# EAGLE design PDM_no_main_relay (EAGLE 7.7.0)
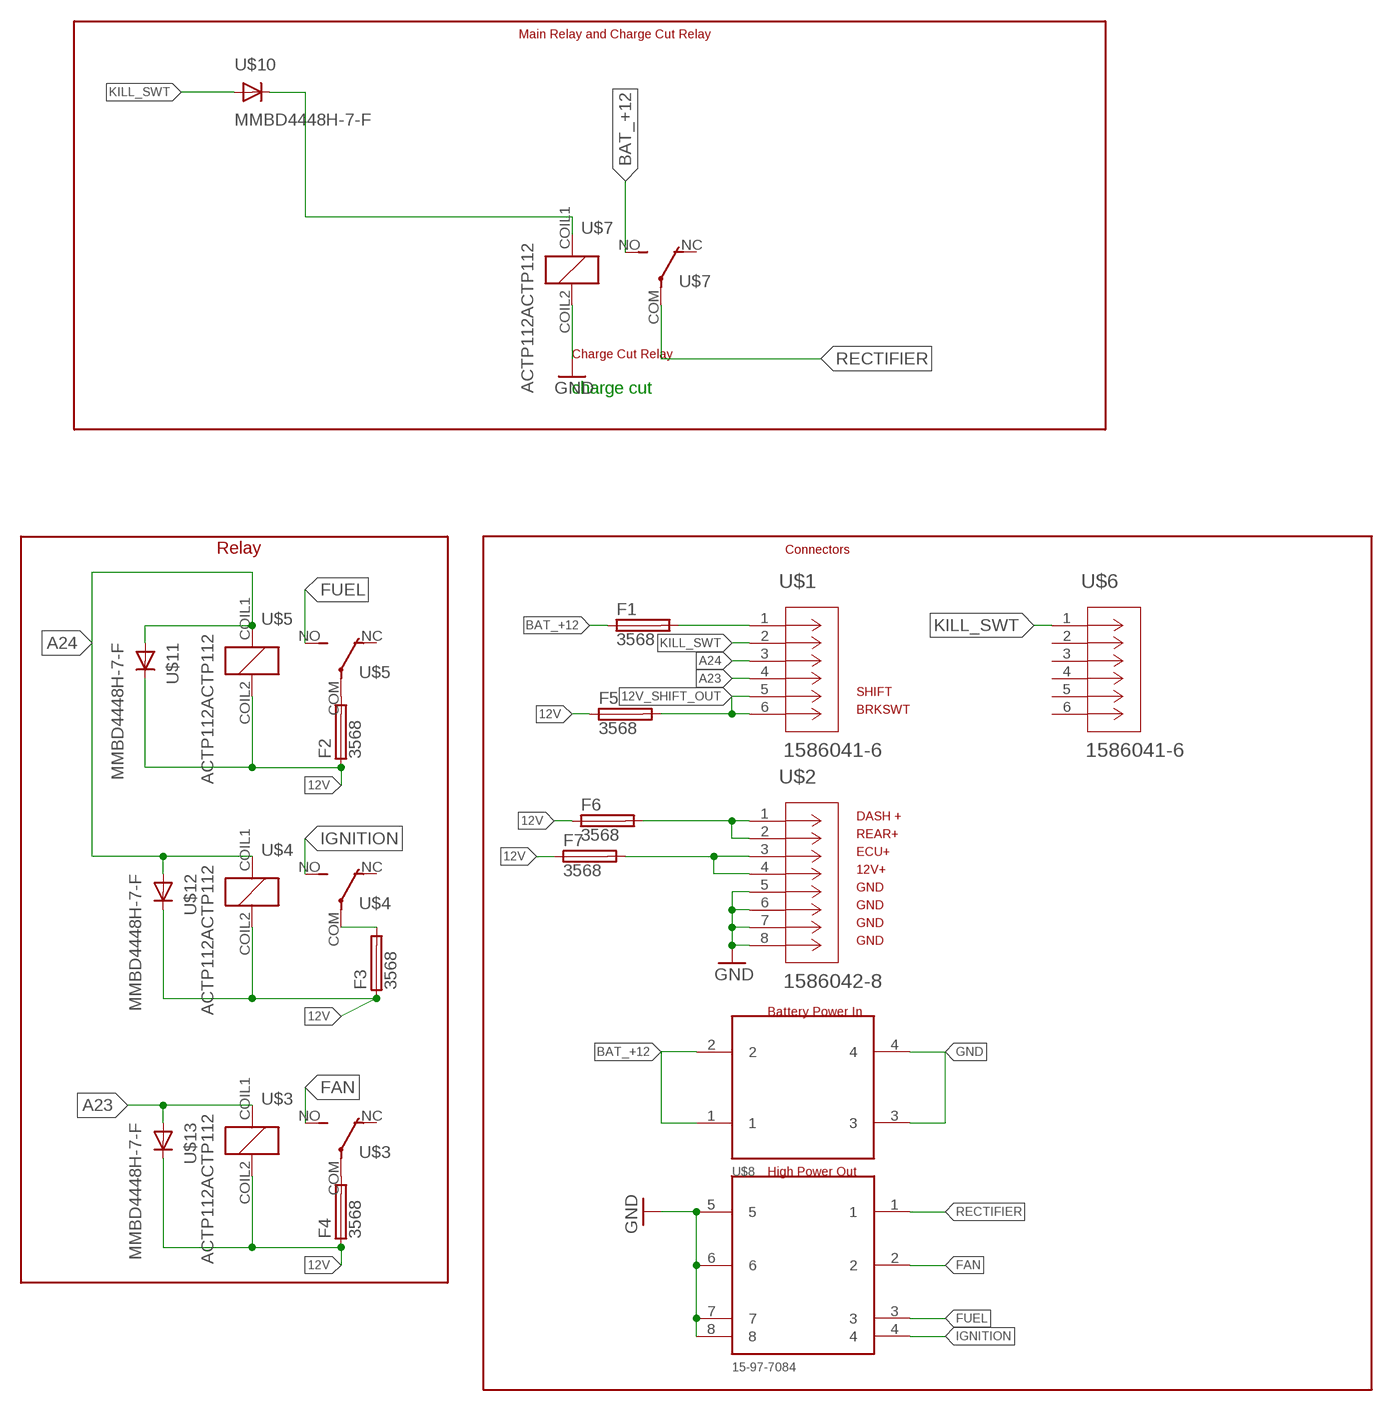
[diagram p0: schematic, sheet 1]

## Parts
F1  3568  [3568]
F2  3568  [3568]
F3  3568  [3568]
F4  3568  [3568]
F5  3568  [3568]
F6  3568  [3568]
F7  3568  [3568]
U$1  1586041-6  [1586041-6]
U$2  1586042-8  [1586042-8]
U$3  ACTP112ACTP112  [ACTP112]
U$4  ACTP112ACTP112  [ACTP112]
U$5  ACTP112ACTP112  [ACTP112]
U$6  1586041-6  [1586041-6]
U$7  ACTP112ACTP112  [ACTP112]
U$8  15-97-7084  [15-97-7084]
U$9  15-97-8043  [15-97-8043]
U$10  MMBD4448H-7-F  [SOT23-3]
U$11  MMBD4448H-7-F  [SOT23-3]
U$12  MMBD4448H-7-F  [SOT23-3]
U$13  MMBD4448H-7-F  [SOT23-3]

## Nets
12V: F2.1 F2.2 F3.1 F3.2 F4.1 F4.2 F5.1 F5.2 F6.1 F6.2 F7.1 F7.2 U$3.COIL2 U$4.COIL2 U$5.COIL2 U$11.3(C) U$12.3(C) U$13.3(C)
12V_DAQ_OUT: F6.3 F6.4 U$2.1 U$2.2
12V_FUSED_ECU: F7.3 F7.4 U$2.3 U$2.4
12V_SHIFT_OUT: F5.3 F5.4 U$1.5 U$1.6
A23: U$1.4 U$3.COIL1 U$13.1(A)
A24: U$1.3 U$4.COIL1 U$5.COIL1 U$11.1(A) U$12.1(A)
BAT_+12: F1.1 F1.2 U$7.NO U$9.1 U$9.2
BAT_+12_FUSED: F1.3 F1.4 U$1.1
CHARGE_CUT_IN: U$7.COIL1 U$10.3(C)
FAN: U$3.NO U$8.2
FAN_12V: F4.3 F4.4 U$3.COM
FUEL: U$5.NO U$8.3
FUEL_12V: F2.3 F2.4 U$5.COM
GND: U$2.5 U$2.6 U$2.7 U$2.8 U$7.COIL2 U$8.5 U$8.6 U$8.7 U$8.8 U$9.3 U$9.4
IGN_12V: F3.3 F3.4 U$4.COM
IGNITION: U$4.NO U$8.4
KILL_SWT: U$1.2 U$6.1 U$10.1(A)
RECTIFIER: U$7.COM U$8.1
Unconnected: U$3.NC U$4.NC U$5.NC U$6.2 U$6.3 U$6.4 U$6.5 U$6.6 U$7.NC

## Notes on the sheet
- Main Relay and Charge Cut Relay
- Charge Cut Relay
- charge cut
- Relay | Connectors
- SHIFT
- BRKSWT
- DASH +
- REAR+
- ECU+
- 12V+
- GND
- GND
- GND
- GND
- Battery Power In
- High Power Out

## Library data of the parts
F1-F7 = Keystone:3568: Mini ATC Fuse Holder 20A 500V 1 Circuit Blade PCB
U$1 U$6 = BMS Lbr:1586041-6: TE VAL-U-LOK TPA 6 Pin Header
U$2 = BMS Lbr:1586042-8: 1586042-8 8 pin Val-U-Lock TPA
U$3-U$5 U$7 = panasonic:ACTP112: ACTP112 Through-Hole Micro Relay
U$8 = molex:15-97-7084
U$9 = molex:15-97-8043
U$10-U$13 = diodes-inc:MMBD4448H-7-F

## Board
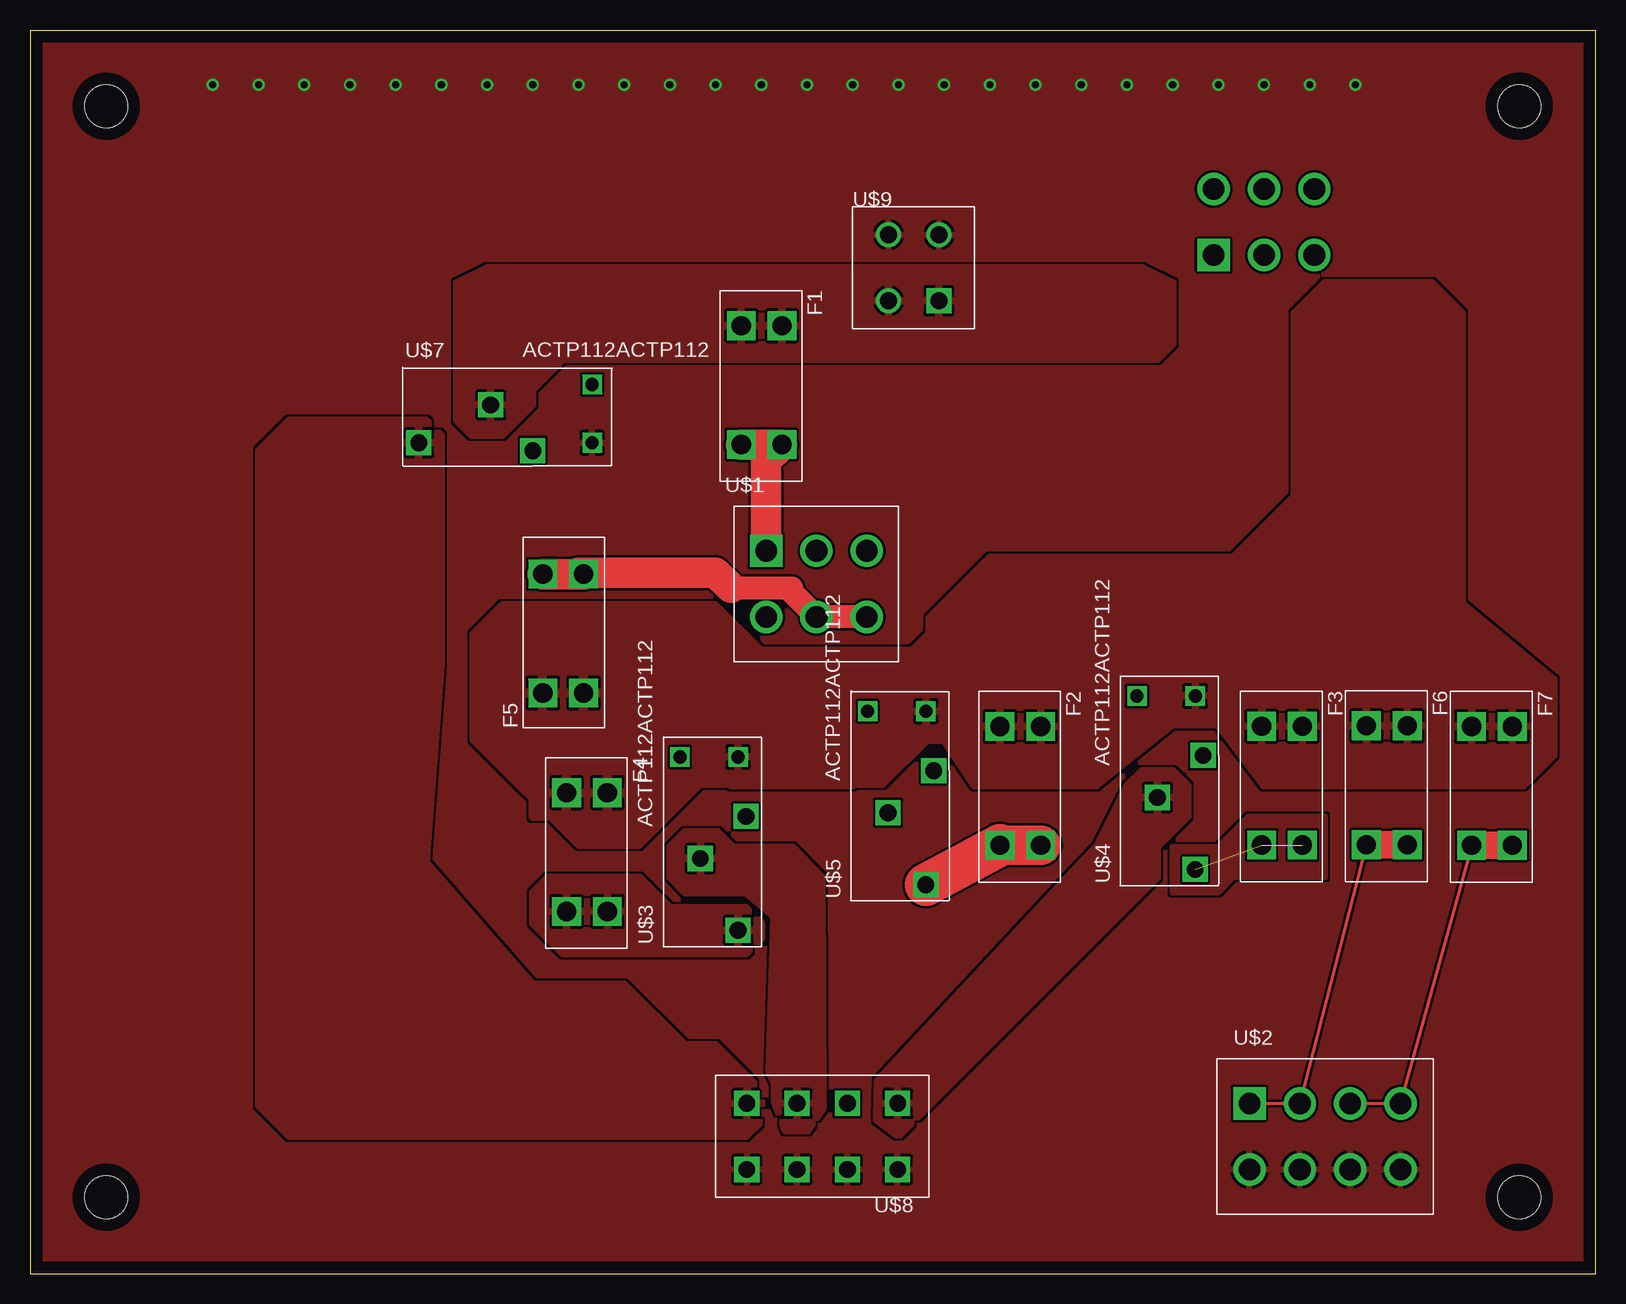
[diagram p1: board, top side]
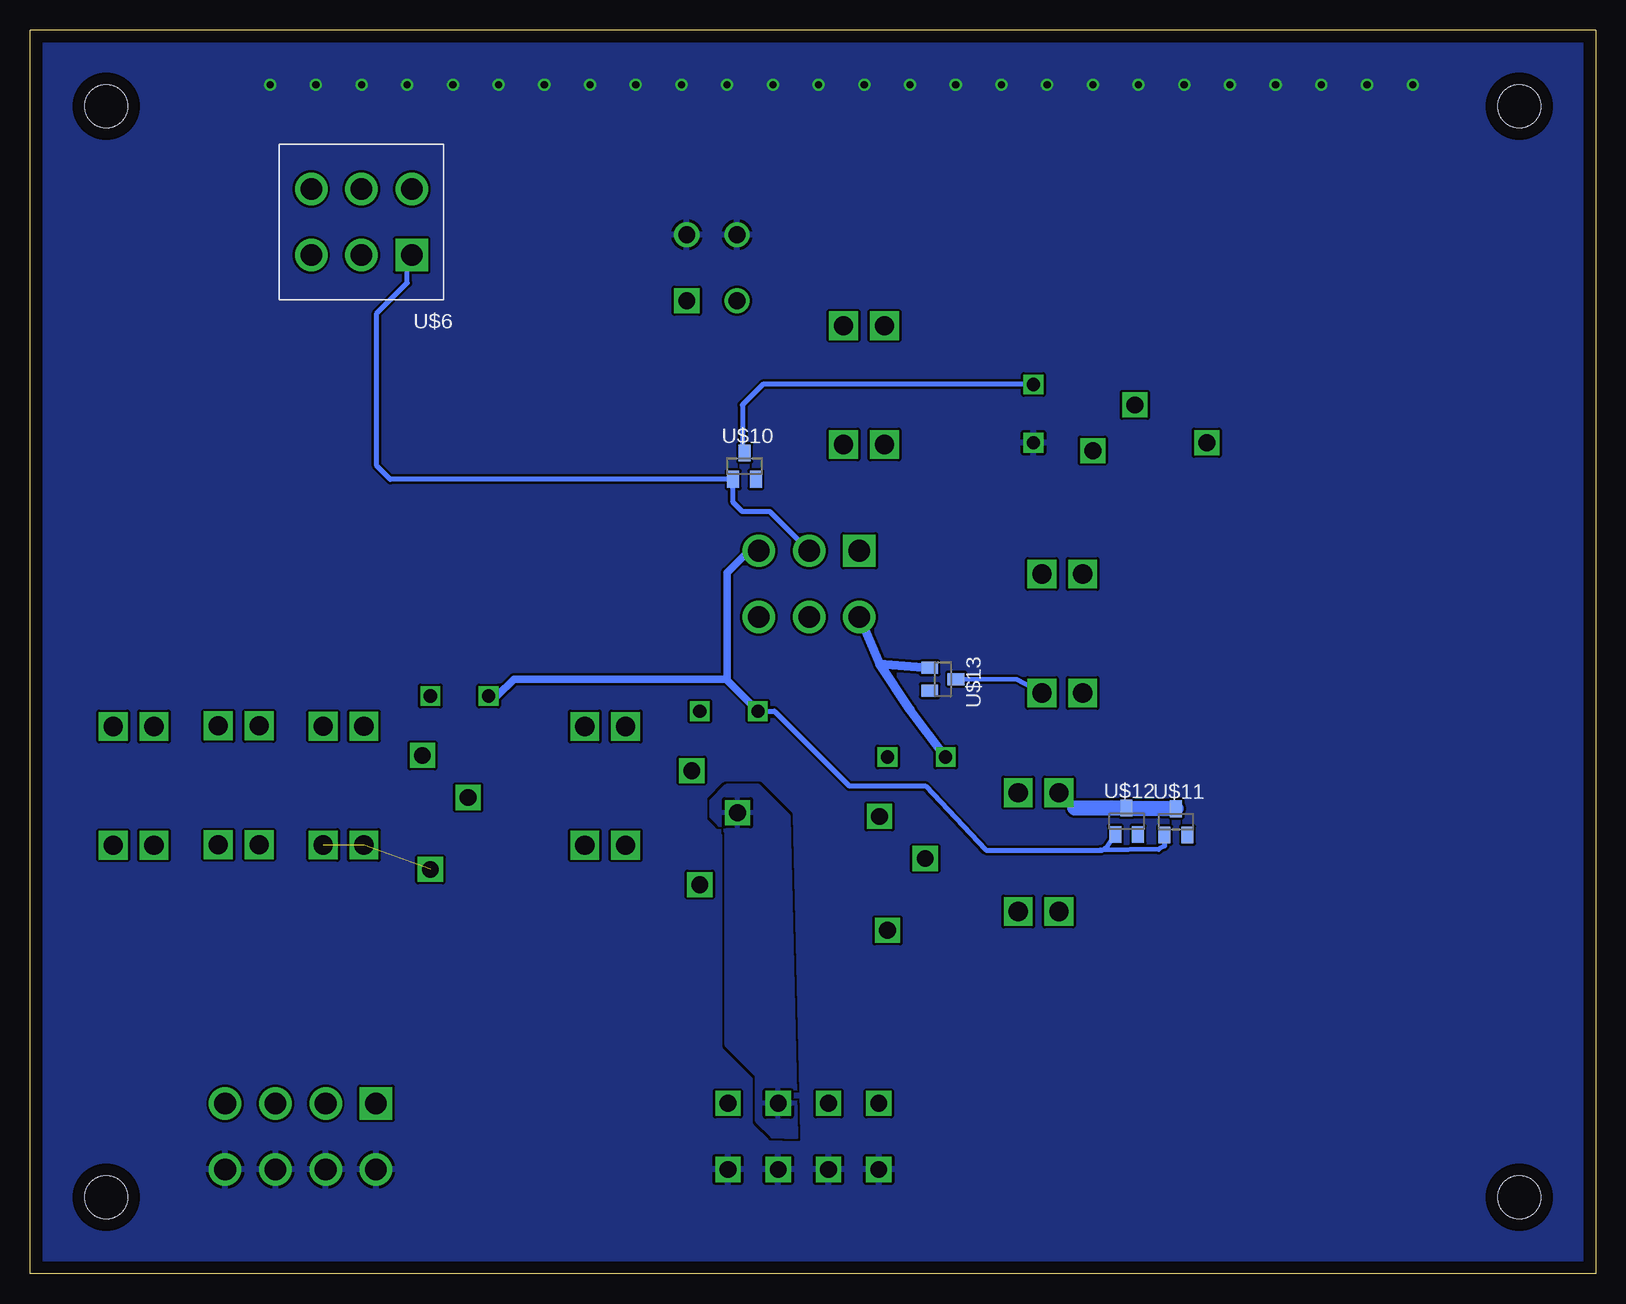
[diagram p2: board, bottom side, seen from below]

Size 130.51 x 103.63 mm. Coordinates in mm from the lower left corner, seen from the top.
Outline: 0,0 130.5,0 130.5,103.63 0,103.63 0,0
Copper layers (1*16): Top 0.035mm / dielectric 1.5mm / Bottom 0.035mm
Design rules "default": minimum track width 10mil, minimum drill 24mil, track to track 8mil, track to pad 8mil, pad to pad 8mil, via to via 8mil, smd to smd 8mil, copper to edge 40mil, drill to drill 8mil, minimum pad ring 10mil, minimum via ring 8mil, stop-mask expansion 4mil, vias tented up to drill 0mil, thermal gap 10mil
Holes 3.56 mm at 6.35,6.35 124.16,6.35 124.16,97.28 6.35,97.28

### Footprints (pad centres in the part's own frame; a part is rotated, then mirrored left to right if it is on the bottom)
3568 = drill 1.6 square: 1 -4.953,1.702; 2 -4.953,-1.702; 3 4.953,1.702; 4 4.953,-1.702
1586041-6 = drill 1.803 square: 1 -4.191,2.756 | drill 1.803: 2 0,2.756; 3 4.191,2.756; 4 -4.191,-2.756; 5 0,-2.756; 6 4.191,-2.756
1586042-8 = drill 1.803 square: 1 -6.287,2.756 | drill 1.803: 2 -2.095,2.756; 3 2.095,2.756; 4 6.287,2.756; 5 -6.287,-2.756; 6 -2.095,-2.756; 7 2.095,-2.756; 8 6.287,-2.756
ACTP112 = drill 1.092 square: COIL1 4.953,5.512; COIL2 4.953,0.66 | drill 1.397 square: COM -9.5,0.66; NC 0,0; NO -3.505,3.81
15-97-7084 = drill 1.397 square: 1 6.287,-2.756; 2 2.095,-2.756; 3 -2.095,-2.756; 4 -6.287,-2.756; 5 6.287,2.756; 6 2.095,2.756; 7 -2.095,2.756; 8 -6.287,2.756
15-97-8043 = drill 1.397 pad 1.803 square: 1 2.101,-2.756 | drill 1.397 pad 1.803: 2 -2.101,-2.756; 4 -2.101,2.756 | drill 1.397 pad 1.829: 3 2.101,2.756
SOT23-3 = smd 1 x 1.4: 1 -0.95,-1.1; 2 0.95,-1.1; 3 0,1.1

### Placement (x,y rotation side)
F1  60.99,74.04 270 top
F2  82.55,40.64 270 top
F3  104.37,40.67 270 top
F4  46.43,35.13 270 top
F5  44.45,53.34 90 top
F6  113.11,40.69 270 top
F7  121.87,40.64 270 top
U$1  65.56,57.48 0 top
U$2  107.95,11.43 0 top
U$3  59.69,38.1 90 top
U$4  97.79,43.18 90 top
U$5  75.34,41.91 90 top
U$6  102.87,87.63 180 bottom
U$7  41.91,68.58 0 top
U$8  66.04,11.43 180 top
U$9  73.66,83.82 0 top
U$10  70.94,67.28 0 bottom
U$11  34.98,37.64 0 bottom
U$12  39.09,37.69 0 bottom
U$13  54.41,49.53 270 bottom

### Tracks (layer width: path | path; a pad name or v marks a point on that pad's centre or on a via)
12V
  Bottom 0.381: U$13.3 48.26,49.53 F5.2
  Bottom 0.762: 39.04,38.74 U$12.3 | 43.44,38.79 F4.2
  Bottom 1.27: U$11.3 39.04,38.74 | U$12.3 43.44,38.79
  pour Top: 99.06,45.72 102.87,40.64 124.46,40.64 127,43.18 127,49.53 119.38,55.88 119.38,80.01 116.84,82.55 107.95,82.55 105.41,80.01 105.41,64.77 100.33,59.69 80.01,59.69 74.93,54.61 74.93,53.34 71.12,49.53 62.23,49.53 57.15,44.45 57.15,41.91 58.42,40.64 68.58,40.64 72.39,44.45 76.2,44.45 78.74,40.64 88.9,40.64 95.25,45.72
  pour Top: 40.64,49.53 40.64,45.72 40.64,41.91 41.91,40.64 41.91,38.1 49.53,38.1 50.8,39.37 50.8,43.18 49.53,44.45 49.53,49.53 48.26,50.8 41.91,50.8
  pour Top: 39.37,55.88 57.15,55.88 60.96,52.07 76.2,52.07 78.74,49.53 78.74,44.45 74.93,44.45 71.12,40.64 55.88,40.64 50.8,35.56 45.72,35.56 36.83,44.45 36.83,53.34
12V_DAQ_OUT
  Top 0.254: U$2.1 U$2.2 F6.4
  Top 2.286: F6.4 F6.3
12V_FUSED_ECU
  Top 0.254: F7.4 U$2.4 U$2.3
  Top 2.286: F7.4 F7.3
12V_SHIFT_OUT
  Top 1.905: 58.42,57.15 63.5,57.15 63.5,56.78 U$1.5 U$1.6
  Top 2.54: F5.3 F5.4 45.85,58.29 45.72,58.42 57.15,58.42 58.42,57.15
A23
  Bottom 0.762: U$1.4 59.69,50.8 | 59.69,50.8 U$13.1 | U$3.COIL1 57.15,46.99 59.69,50.8
A24
  Bottom 0.406: U$5.COIL1 68.45,46.86 62.23,40.64 55.88,40.64 50.8,35.28 41.3,35.28 | U$12.1 40.7,35.6 41.12,35.28 41.25,35.28 41.3,35.28 | 35.93,36.46 U$11.1 35.93,35.65 36.42,35.36 41.3,35.28
  Bottom 0.635: U$4.COIL1 91.57,48.13 90.17,49.53 72.49,49.53 72.44,49.48 | 72.44,49.48 U$5.COIL1 | U$1.3 70.57,60.24 72.39,58.42 72.39,49.53 72.44,49.48
BAT_+12
  pour Top (isolate 0.406): 36.83,69.85 39.37,69.85 41.91,72.39 41.91,73.66 44.45,76.2 93.98,76.2 95.25,77.47 95.25,82.55 92.71,83.82 38.1,83.82 35.56,82.55 35.56,71.12
BAT_+12_FUSED
  Top 2.54: F1.4 F1.3 61.37,67.77 U$1.1
CHARGE_CUT_IN
  Bottom 0.406: U$7.COIL1 69.42,74.09 71.12,72.39 71.12,68.58 71.12,68.56 U$10.3
FAN
  pour Top (isolate 0.406): 53.34,35.56 54.61,36.83 57.33,36.8 58.6,35.53 63.5,35.56 66.04,33.02 66.12,13.77 64.8,11.91 62.99,11.91 62.05,14.33 62.08,15.82 61.59,16.84 62.03,29.77 59.69,31.75 54.61,31.75 53.34,33.02
FAN_12V
  pour Top (isolate 0.406): 43.18,33.02 41.91,31.75 41.91,29.21 44.45,26.67 59.69,26.67 60.96,27.94 60.96,29.21 59.69,30.48 53.34,30.48 50.8,33.02
FUEL
  pour Bottom (isolate 0.406): 67.31,38.1 66.67,11.35 68.58,11.43 69.85,12.7 69.85,16.51 72.39,19.05 72.39,36.83 73.66,38.1 73.66,39.37 72.39,40.64 69.85,40.64
FUEL_12V
  Top 3.302: F2.3 F2.4
  Top 3.556: F2.4 U$5.COM
GND  (via drill 0.6)
  other vias: 15.24,99.06 19.05,99.06 22.86,99.06 26.67,99.06 30.48,99.06 34.29,99.06 38.1,99.06 41.91,99.06 45.72,99.06 49.53,99.06 53.34,99.06 57.15,99.06 60.96,99.06 64.77,99.06 68.58,99.06 72.39,99.06 76.2,99.06 80.01,99.06 83.82,99.06 87.63,99.06 91.44,99.06 95.25,99.06 99.06,99.06 102.87,99.06 106.68,99.06 110.49,99.06
  pour Top (rank 2): -1.27,104.14 132.08,104.14 132.08,-1.27 -1.27,-1.27
  pour Bottom (rank 3): -1.27,104.14 132.08,104.14 132.08,-1.27 -1.27,-1.27
IGN_12V  (2 unrouted)
IGNITION
  pour Top (isolate 0.254): 87.63,34.29 70.66,16.05 70.56,12.8 72.39,11.43 93.98,33.02 93.98,35.56 96.52,38.1 96.52,40.64 95.25,41.91 92.71,41.91 91.44,40.64 88.9,35.56
KILL_SWT
  Bottom 0.406: U$1.2 68.82,63.5 71.12,63.5 71.89,64.27 U$10.1 100.47,66.19 101.6,67.31 101.6,80.01 99.06,82.55 99.06,84.49 U$6.1
N$1
  pour Top: 95.25,35.56 99.06,35.56 101.6,38.1 107.95,38.1 107.95,33.02 100.33,33.02 99.06,31.75 95.25,31.75
RECTIFIER
  pour Top (isolate 0.254): 21.59,71.12 33.02,71.12 34.29,69.85 34.29,50.8 33.02,34.29 41.91,24.13 49.53,24.13 54.61,19.05 57.15,19.05 60.96,15.24 60.96,12.7 59.69,11.43 21.59,11.43 19.05,13.97 19.05,68.58